# EAGLE design SOIC8 (EAGLE 7.3.0)
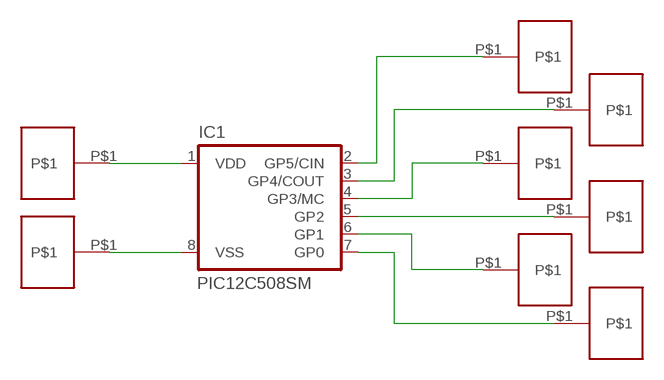
[diagram p0: schematic, sheet 1]

## Parts
IC1  PIC12C508SM  [SO-08M]
U$1  PAD50X100MIL  [100X50MIL_PAD]
U$2  PAD50X100MIL  [100X50MIL_PAD]
U$3  PAD50X100MIL  [100X50MIL_PAD]
U$4  PAD50X100MIL  [100X50MIL_PAD]
U$5  PAD50X100MIL  [100X50MIL_PAD]
U$6  PAD50X100MIL  [100X50MIL_PAD]
U$7  PAD50X100MIL  [100X50MIL_PAD]
U$8  PAD50X100MIL  [100X50MIL_PAD]

## Nets
N$1: IC1.1(VDD) U$1.P$1
N$2: IC1.8(VSS) U$2.P$1
N$3: IC1.2(GP5/CIN) U$8.P$1
N$4: IC1.3(GP4/COUT) U$6.P$1
N$5: IC1.4(GP3/MC) U$3.P$1
N$6: IC1.5(GP2) U$5.P$1
N$7: IC1.6(GP1) U$4.P$1
N$8: IC1.7(GP0) U$7.P$1

## Library data of the parts
IC1 = microchip:PIC12C*?: MICROCONTROLLER; MF: MICROCHIP; MPN: PIC12C508-04I/SM; OC_FARNELL: 1196846; OC_NEWARK: 96K3762
U$1-U$8 = generic_smd:PAD

## Board
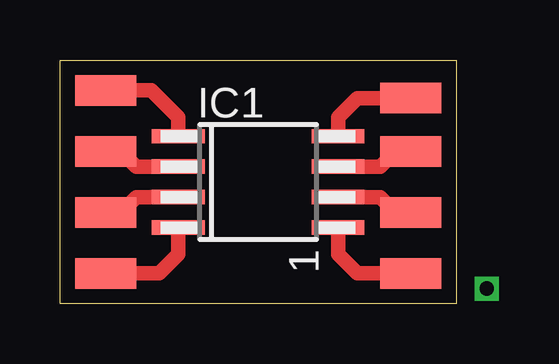
[diagram p1: board, top side]
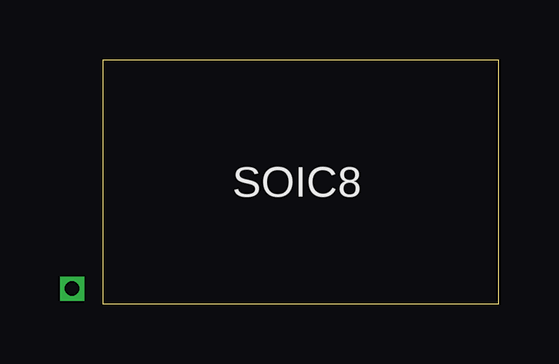
[diagram p2: board, bottom side, seen from below]

Size 16.51 x 10.16 mm. Coordinates in mm from the lower left corner, seen from the top.
Outline: 0,0 0,10.16 16.51,10.16 16.51,0 0,0
Copper layers (1*16): Top 0.035mm / dielectric 1.5mm / Bottom 0.035mm
Design rules "default": minimum track width 10mil, minimum drill 24mil, track to track 8mil, track to pad 8mil, pad to pad 8mil, via to via 8mil, smd to smd 8mil, copper to edge 40mil, drill to drill 8mil, minimum pad ring 10mil, minimum via ring 8mil, stop-mask expansion 4mil, vias tented up to drill 0mil, thermal gap 10mil

### Footprints (pad centres in the part's own frame; a part is rotated, then mirrored left to right if it is on the bottom)
SO-08M = smd 0.6 x 2.2: 1 -1.905,-3.33; 2 -0.635,-3.33; 3 0.635,-3.33; 4 1.905,-3.33; 5 1.905,3.33; 6 0.635,3.33; 7 -0.635,3.33; 8 -1.905,3.33
100X50MIL_PAD = smd 1.27 x 2.54: P$1 0,0

### Placement (x,y rotation side)
IC1  8.26,5.08 270 top
U$1  1.91,8.89 90 top
U$2  14.61,8.57 90 top
U$3  1.91,1.27 90 top
U$4  14.61,3.81 90 top
U$5  14.61,1.27 90 top
U$6  1.91,3.81 90 top
U$7  14.61,6.35 90 top
U$8  1.91,6.35 90 top

### Tracks (layer width: path | path; a pad name or v marks a point on that pad's centre or on a via)
N$1
  Top 0.61: IC1.1 4.92,7.78 3.81,8.89 U$1.P$1
N$2
  Top 0.61: IC1.8 11.59,7.78 12.38,8.57 U$2.P$1
N$3
  Top 0.61: IC1.2 3.17,5.71 2.54,6.35 U$8.P$1
N$4
  Top 0.61: IC1.3 3.17,4.45 2.54,3.81 U$6.P$1
N$5
  Top 0.61: IC1.4 4.92,2.07 4.13,1.27 U$3.P$1
N$6
  Top 0.61: IC1.5 11.59,2.07 12.38,1.27 U$5.P$1
N$7
  Top 0.61: IC1.6 13.34,4.45 13.97,3.81 U$4.P$1
N$8
  Top 0.61: IC1.7 13.34,5.71 13.65,6.03 U$7.P$1
N$9  (via drill 0.6)
  other vias: 17.78,0.64

### Text on the board
tPlace: 1
bPlace: SOIC8
Document: via required to force drill file generation